# EAGLE schematic mbedXdotShield-V_1_0_0 (EAGLE 7.6.0)

## Sheet 1 of 5
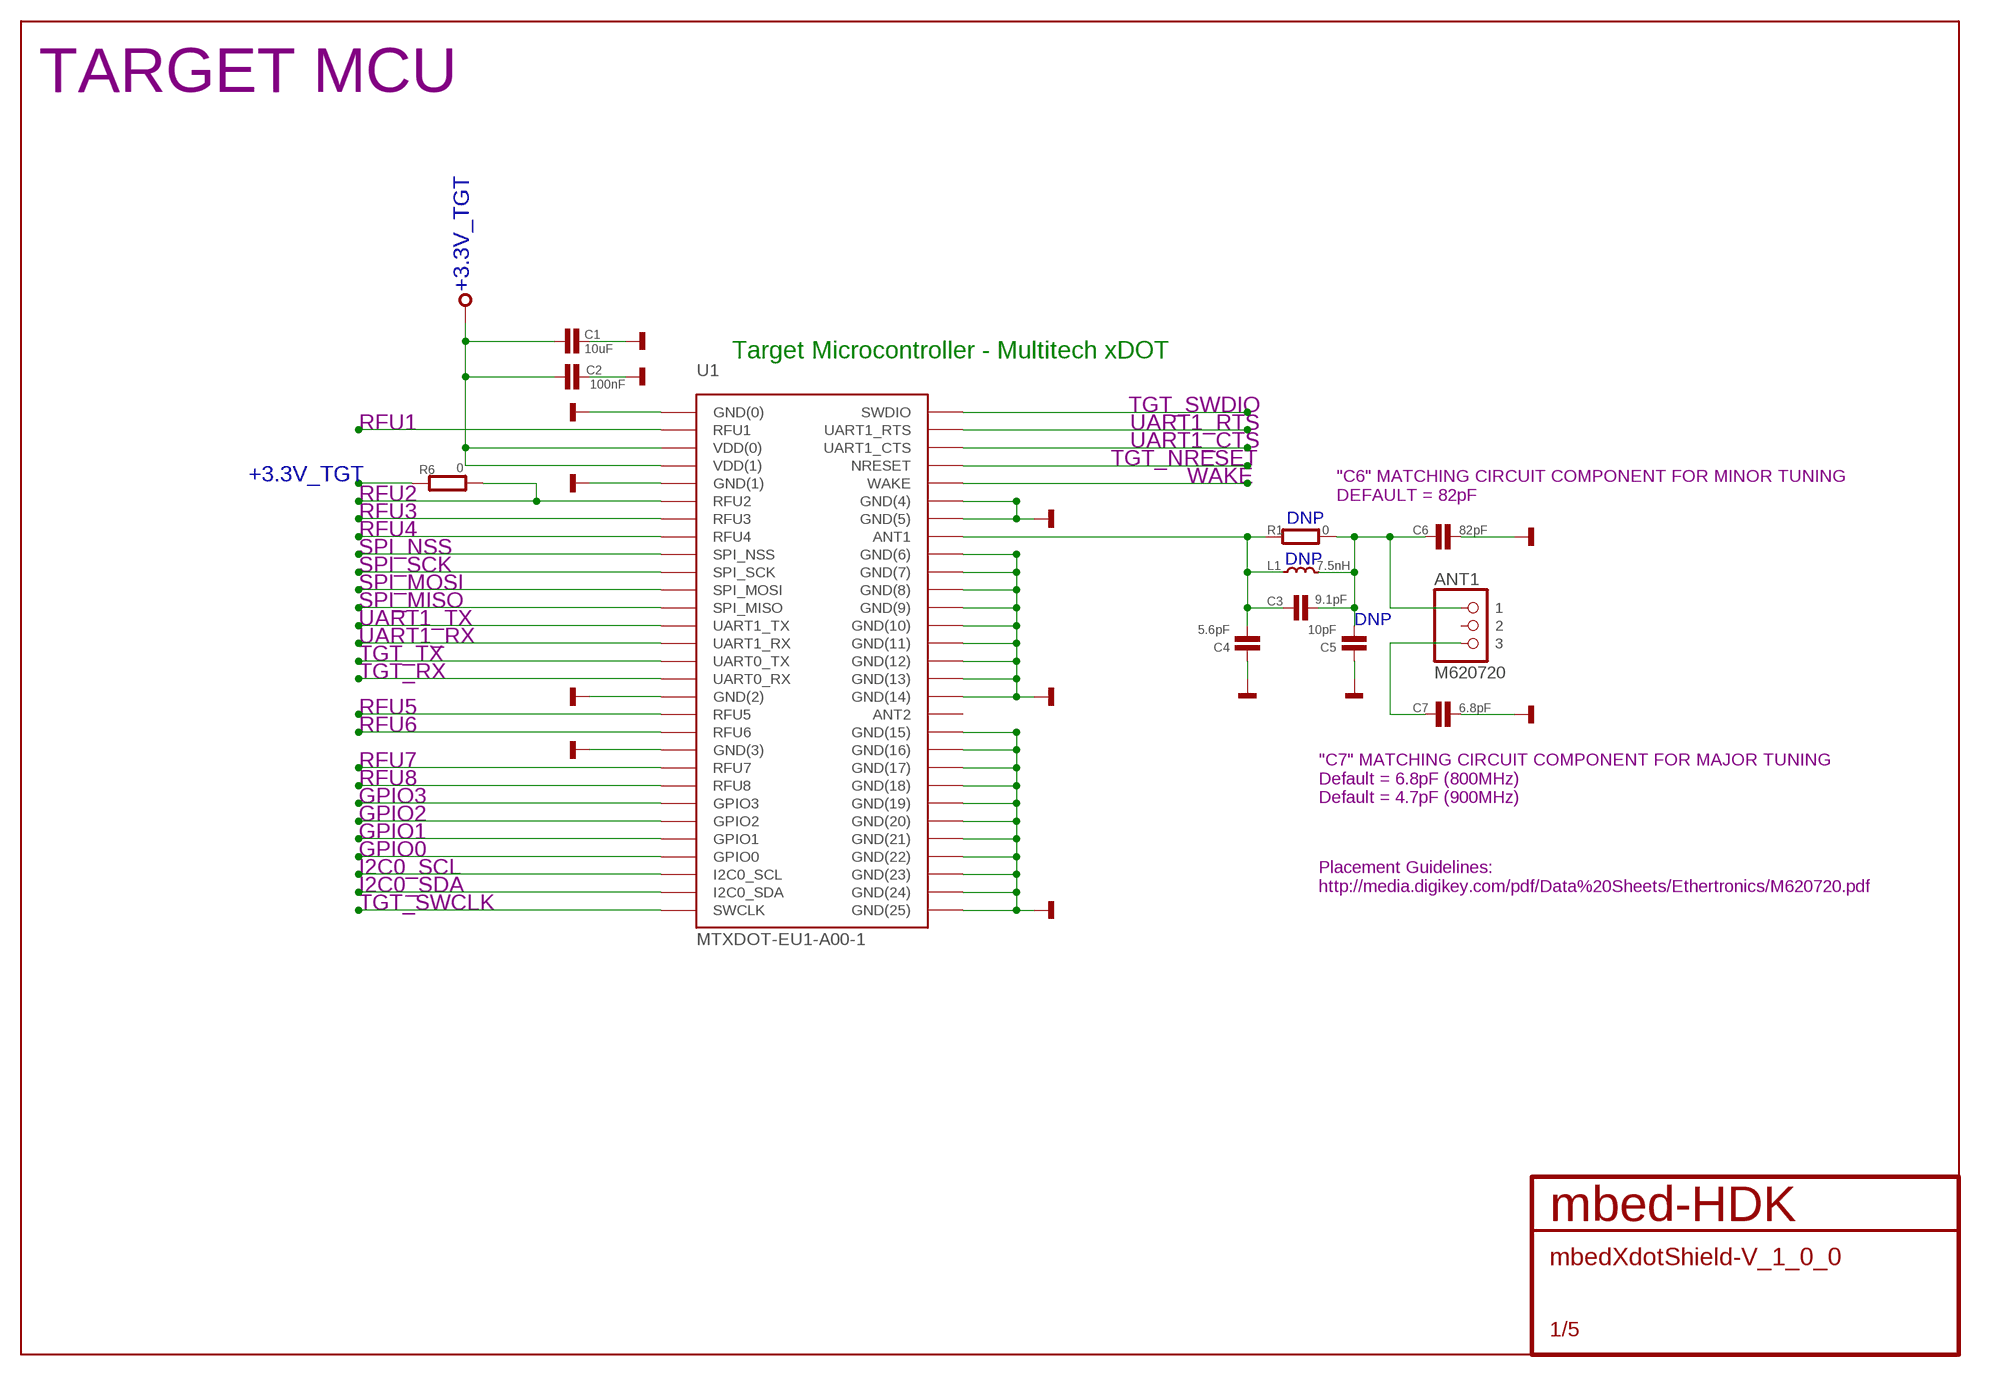
[diagram p0: schematic, sheet 1]

### Parts
ANT1  M620720  [M620720]
C1  10uF  CAPACITOR0603  [0603]
C2  100nF  CAPACITOR0603  [0603]
C3  9.1pF  CAPACITOR0402  [0402]
C4  5.6pF  CAPACITOR0402  [0402]
C5  10pF  CAPACITOR0402  [0402]
C6  82pF  CAPACITOR0402  [0402]
C7  6.8pF  CAPACITOR0402  [0402]
L1  7.5nH  INDUCTOR0402  [0402]
R1  0  RESISTOR0402  [0402]
R6  0  RESISTOR0402  [0402]
U1  MTXDOT-EU1-A00-1  [MTXDOT-EU1/NA1-A00-1]

### Nets
+3.3V_TGT: C1.1 C2.1 R6.1 U1.P$3(VDD(0)) U1.P$4(VDD(1)) ; also sheet 2,4,5
ANT1: C3.1 C4.2 L1.1 R1.1 U1.P$37(ANT1)
GND: C1.2 C2.2 C4.1 C5.1 C6.1 C7.1 U1.P$1(GND(0)) U1.P$5(GND(1)) U1.P$17(GND(2)) U1.P$20(GND(3)) U1.P$35(GND(4)) U1.P$36(GND(5)) U1.P$38(GND(6)) U1.P$39(GND(7)) U1.P$40(GND(8)) U1.P$41(GND(9)) U1.P$42(GND(10)) U1.P$43(GND(11)) U1.P$44(GND(12)) U1.P$45(GND(13)) U1.P$46(GND(14)) U1.P$48(GND(15)) U1.P$49(GND(16)) U1.P$50(GND(17)) U1.P$51(GND(18)) U1.P$52(GND(19)) U1.P$53(GND(20)) U1.P$54(GND(21)) U1.P$55(GND(22)) U1.P$56(GND(23)) U1.P$57(GND(24)) U1.P$58(GND(25)) ; also sheet 2,3,4,5
GPIO0: U1.P$26(GPIO0) ; also sheet 4
GPIO1: U1.P$25(GPIO1) ; also sheet 4
GPIO2: U1.P$24(GPIO2) ; also sheet 5
GPIO3: U1.P$23(GPIO3) ; also sheet 5
I2C0_SCL: U1.P$27(I2C0_SCL) ; also sheet 5
I2C0_SDA: U1.P$28(I2C0_SDA) ; also sheet 5
N$1: ANT1.P$3 C7.2
N$4: ANT1.P$1 C3.2 C5.2 C6.2 L1.2 R1.2
RFU1: U1.P$2(RFU1)
RFU2: R6.2 U1.P$6(RFU2)
RFU3: U1.P$7(RFU3)
RFU4: U1.P$8(RFU4)
RFU5: U1.P$18(RFU5)
RFU6: U1.P$19(RFU6)
RFU7: U1.P$21(RFU7)
RFU8: U1.P$22(RFU8)
SPI_MISO: U1.P$12(SPI_MISO) ; also sheet 4,5
SPI_MOSI: U1.P$11(SPI_MOSI) ; also sheet 4,5
SPI_NSS: U1.P$9(SPI_NSS) ; also sheet 4,5
SPI_SCK: U1.P$10(SPI_SCK) ; also sheet 4,5
TGT_NRESET: U1.P$33(NRESET) ; also sheet 3,5
TGT_RX: U1.P$16(UART0_RX) ; also sheet 3
TGT_SWCLK: U1.P$29(SWCLK) ; also sheet 3
TGT_SWDIO: U1.P$30(SWDIO) ; also sheet 3
TGT_TX: U1.P$15(UART0_TX) ; also sheet 3
UART1_CTS: U1.P$32(UART1_CTS) ; also sheet 5
UART1_RTS: U1.P$31(UART1_RTS) ; also sheet 5
UART1_RX: U1.P$14(UART1_RX) ; also sheet 5
UART1_TX: U1.P$13(UART1_TX) ; also sheet 5
WAKE: U1.P$34(WAKE) ; also sheet 5
Unconnected: ANT1.P$2 U1.P$47(ANT2)

### Notes on the sheet
- TARGET MCU
- Target Microcontroller - Multitech xDOT
- "C6" MATCHING CIRCUIT COMPONENT FOR MINOR TUNING
  DEFAULT = 82pF
- DNP
- DNP
- DNP
- "C7" MATCHING CIRCUIT COMPONENT FOR MAJOR TUNING
  Default = 6.8pF (800MHz)
  Default = 4.7pF (900MHz)
- Placement Guidelines:
  http://media.digikey.com/pdf/Data%20Sheets/Ethertronics/M620720.pdf

## Sheet 2 of 5
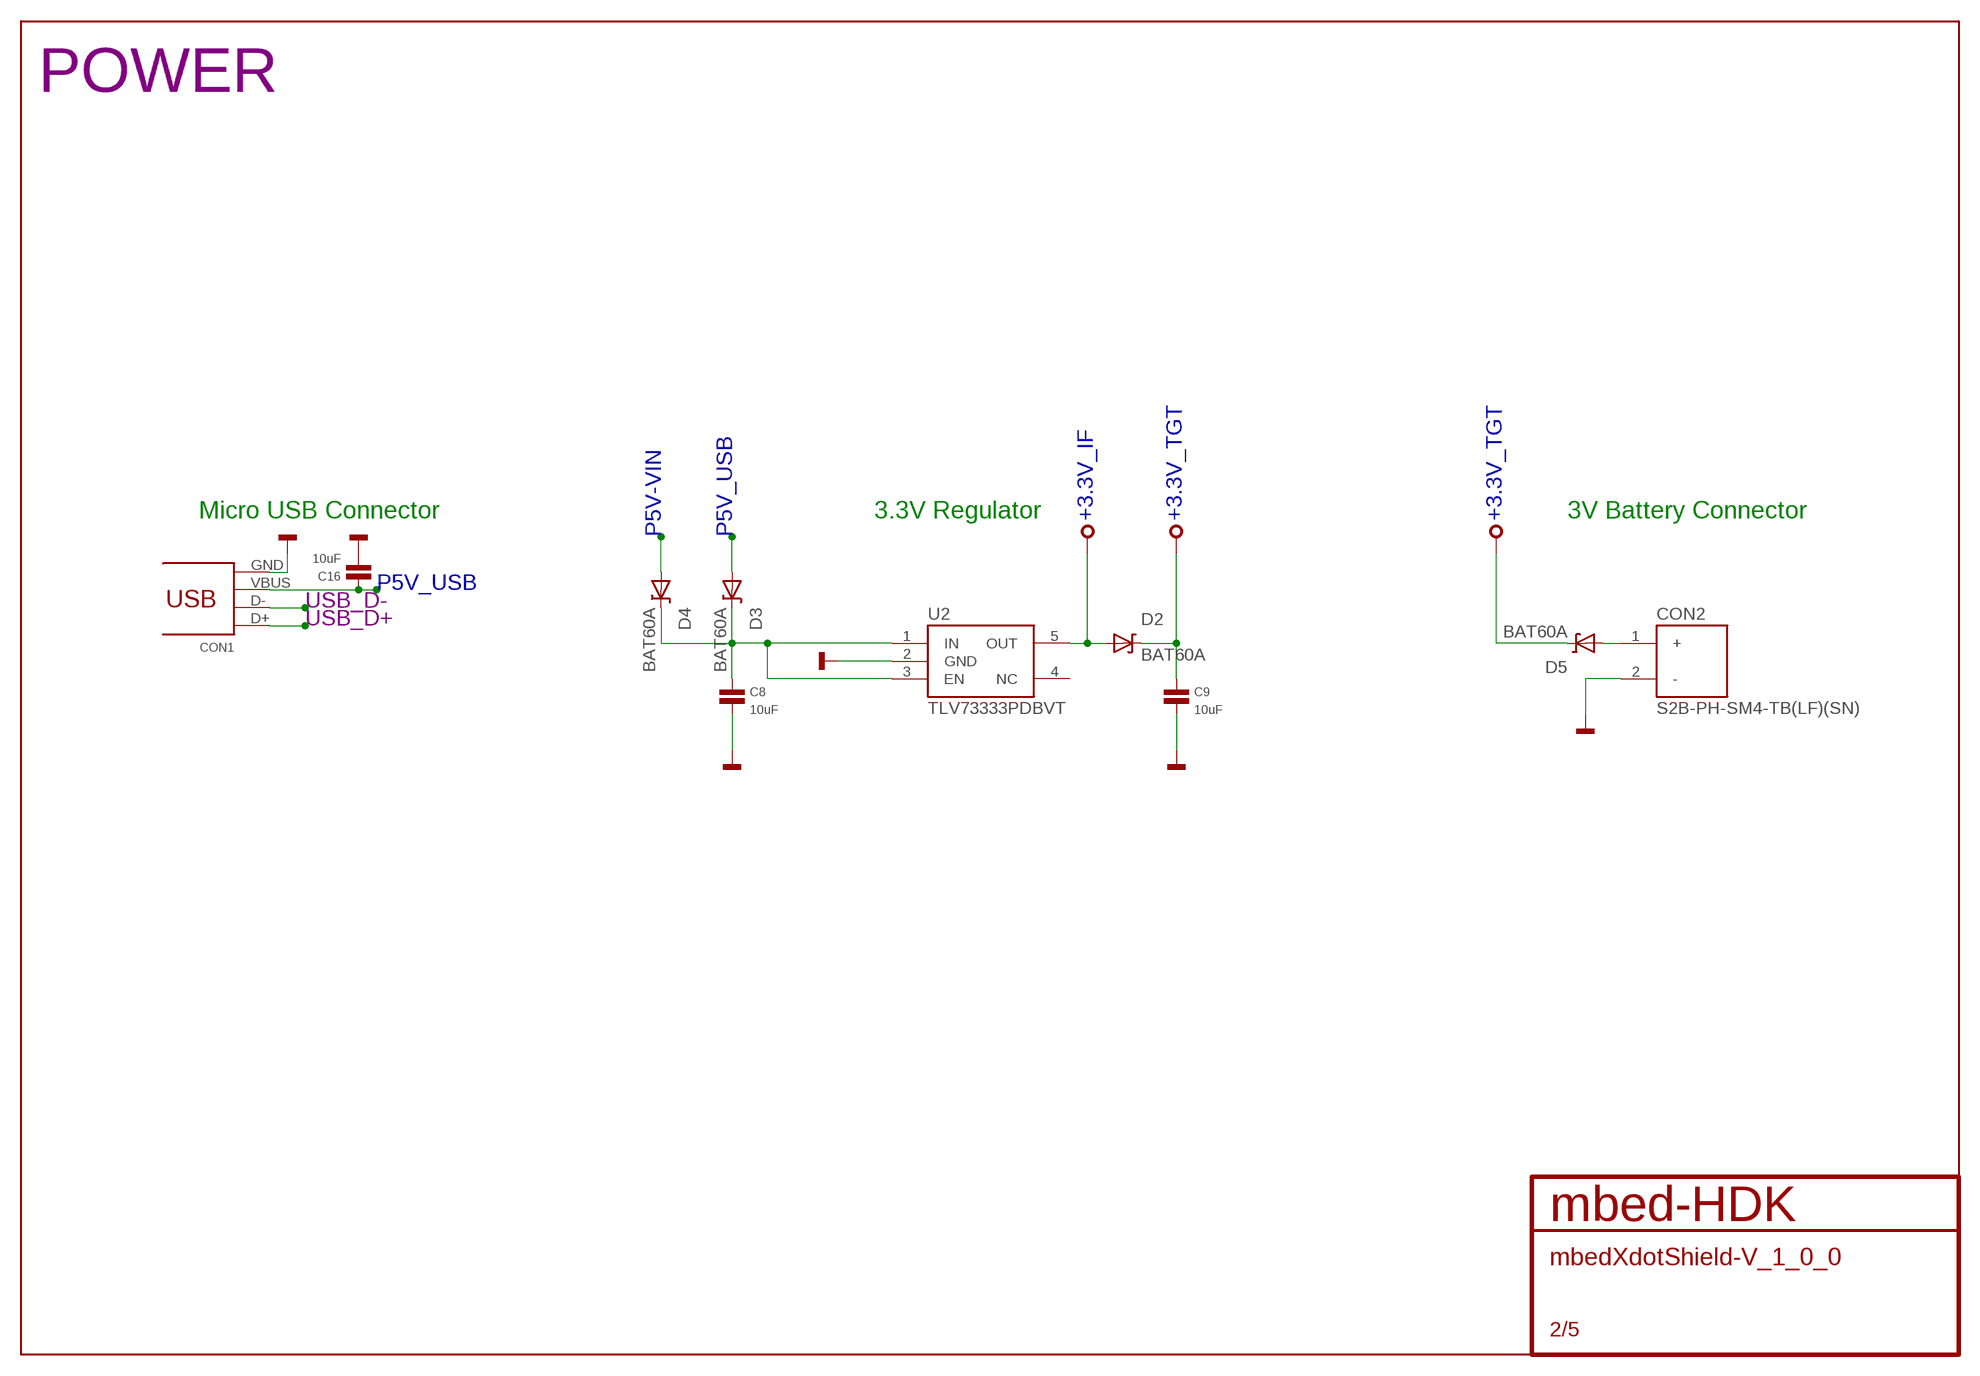
[diagram p1: schematic, sheet 2]

### Parts
C8  10uF  CAPACITOR0603  [0603]
C9  10uF  CAPACITOR0603  [0603]
C16  10uF  CAPACITOR0603  [0603]
CON1  47346-0001  [USB-MICRO-B-H]
CON2  S2B-PH-SM4-TB(LF)(SN)  [S2B-PH-SM4-TB(LF)(SN)]
D2  BAT60A  [SOD323]
D3  BAT60A  [SOD323]
D4  BAT60A  [SOD323]
D5  BAT60A  [SOD323]
U2  TLV73333PDBVT  [SOT23-5]

### Nets
+3.3V_IF: D2.A U2.5(OUT)
+3.3V_TGT: C9.1 D2.K D5.K ; also sheet 1,4,5
GND: C8.2 C9.2 C16.2 CON1.GND CON2.2(-) U2.2(GND) ; also sheet 1,3,4,5
N$25: C8.1 D3.K D4.K U2.1(IN) U2.3(EN)
N$47: CON2.1(+) D5.A
P5V-VIN: D4.A ; also sheet 5
P5V_USB: C16.1 CON1.VBUS D3.A ; also sheet 5
USB_D+: CON1.D+ ; also sheet 3
USB_D-: CON1.D- ; also sheet 3
Unconnected: U2.4(NC)

### Notes on the sheet
- POWER
- Micro USB Connector | 3.3V Regulator | 3V Battery Connector

## Sheet 3 of 5
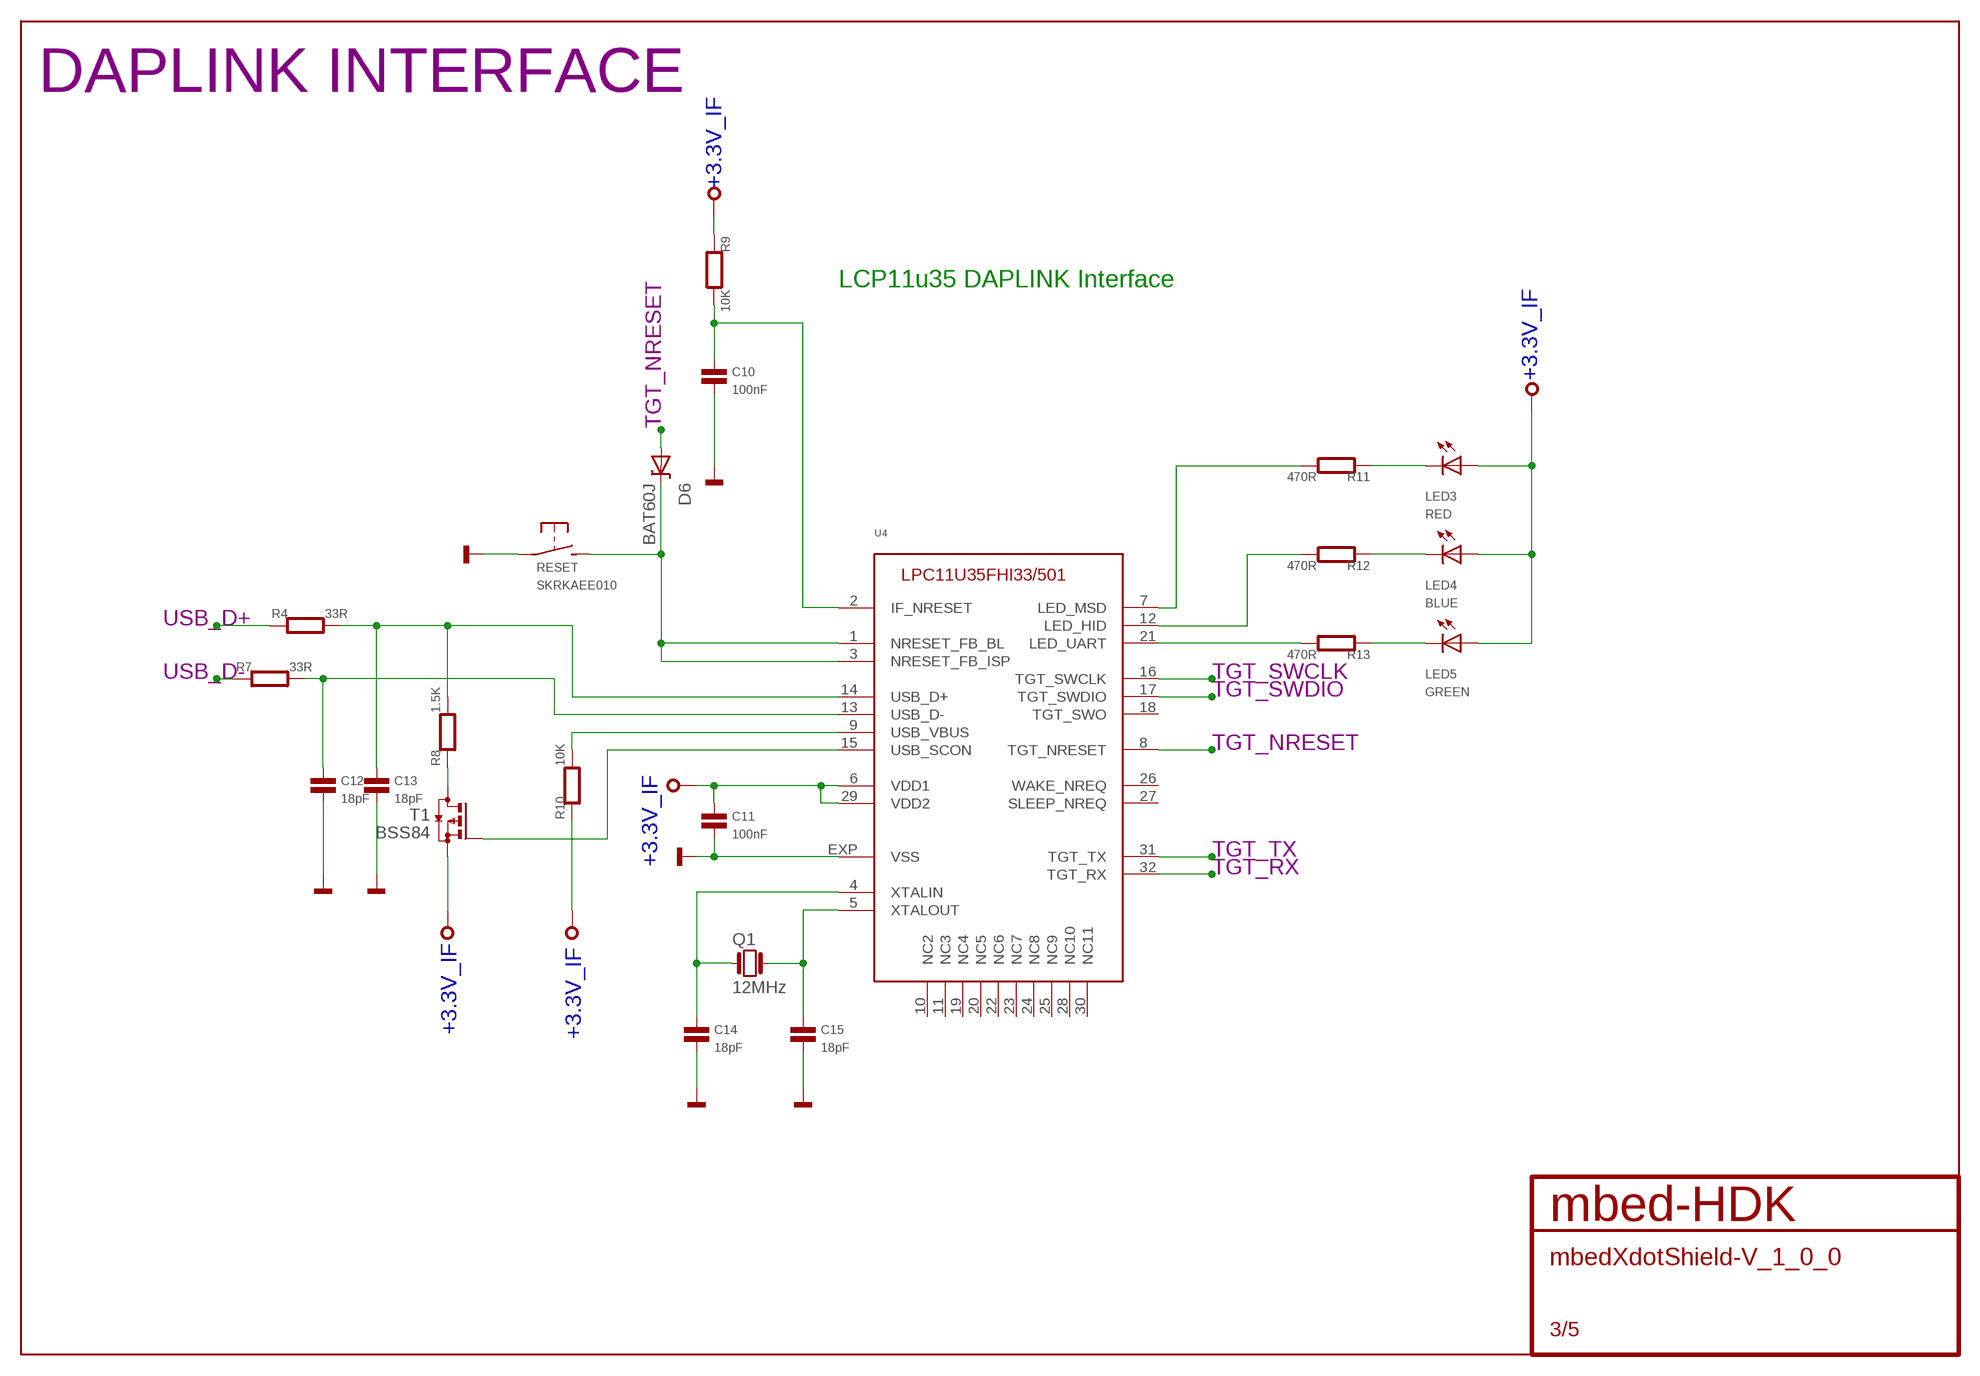
[diagram p2: schematic, sheet 3]

### Parts
C10  100nF  CAPACITOR0402  [0402]
C11  100nF  CAPACITOR0402  [0402]
C12  18pF  CAPACITOR0402  [0402]
C13  18pF  CAPACITOR0402  [0402]
C14  18pF  CAPACITOR0402  [0402]
C15  18pF  CAPACITOR0402  [0402]
D6  BAT60J  [SOD323]
LED3  RED  SMD_LED0603  [CHIPLED_0603]
LED4  BLUE  SMD_LED0603  [CHIPLED_0603]
LED5  GREEN  SMD_LED0603  [CHIPLED_0603]
Q1  12MHz  Q_3.2X2.5  [3.2X.2.5]
R4  33R  RESISTOR0402  [0402]
R7  33R  RESISTOR0402  [0402]
R8  1.5K  RESISTOR0402  [0402]
R9  10K  RESISTOR0402  [0402]
R10  10K  RESISTOR0402  [0402]
R11  470R  RESISTOR0402  [0402]
R12  470R  RESISTOR0402  [0402]
R13  470R  RESISTOR0402  [0402]
RESET  SKRKAEE010  [SKRKAEE010]
T1  BSS84  [SOT23-3]
U4  IF-LPC11U35  [HVQFN33]

### Nets
+3,3V: C11.1 LED3.A LED4.A LED5.A R9.1 R10.1 T1.2(S) U4.6(VDD1) U4.29(VDD2) ; supply symbol labelled +3.3V_IF
GND: C10.2 C11.2 C12.2 C13.2 C14.2 C15.2 RESET.P$1(P) U4.EXP(VSS) ; also sheet 1,2,4,5
HID: R12.2 U4.12(LED_HID)
IF_NRESET: C10.1 R9.2 U4.2(IF_NRESET)
ISP: D6.K RESET.P$2(S) U4.1(NRESET_FB_BL) U4.3(NRESET_FB_ISP)
MSD: R11.2 U4.7(LED_MSD)
N$21: C13.1 R4.2 R8.2 U4.14(USB_D+)
N$24: C12.1 R7.2 U4.13(USB_D-)
N$26: T1.1(G) U4.15(USB_SCON)
N$27: R8.1 T1.3(D)
N$28: R10.2 U4.9(USB_VBUS)
N$34: LED3.C R11.1
N$35: LED4.C R12.1
N$36: LED5.C R13.1
N$37: C15.1 Q1.P$3 U4.5(XTALOUT)
N$40: C14.1 Q1.P$1 U4.4(XTALIN)
TGT_NRESET: D6.A U4.8(TGT_NRESET) ; also sheet 1,5
TGT_RX: U4.32(TGT_RX) ; also sheet 1
TGT_SWCLK: U4.16(TGT_SWCLK) ; also sheet 1
TGT_SWDIO: U4.17(TGT_SWDIO) ; also sheet 1
TGT_TX: U4.31(TGT_TX) ; also sheet 1
UART: R13.2 U4.21(LED_UART)
USB_D+: R4.1 ; also sheet 2
USB_D-: R7.1 ; also sheet 2
Unconnected: U4.10(NC2) U4.11(NC3) U4.18(TGT_SWO) U4.19(NC4) U4.20(NC5) U4.22(NC6) U4.23(NC7) U4.24(NC8) U4.25(NC9) U4.26(WAKE_NREQ) U4.27(SLEEP_NREQ) U4.28(NC10) U4.30(NC11)

### Notes on the sheet
- DAPLINK INTERFACE
- LCP11u35 DAPLINK Interface

## Sheet 4 of 5
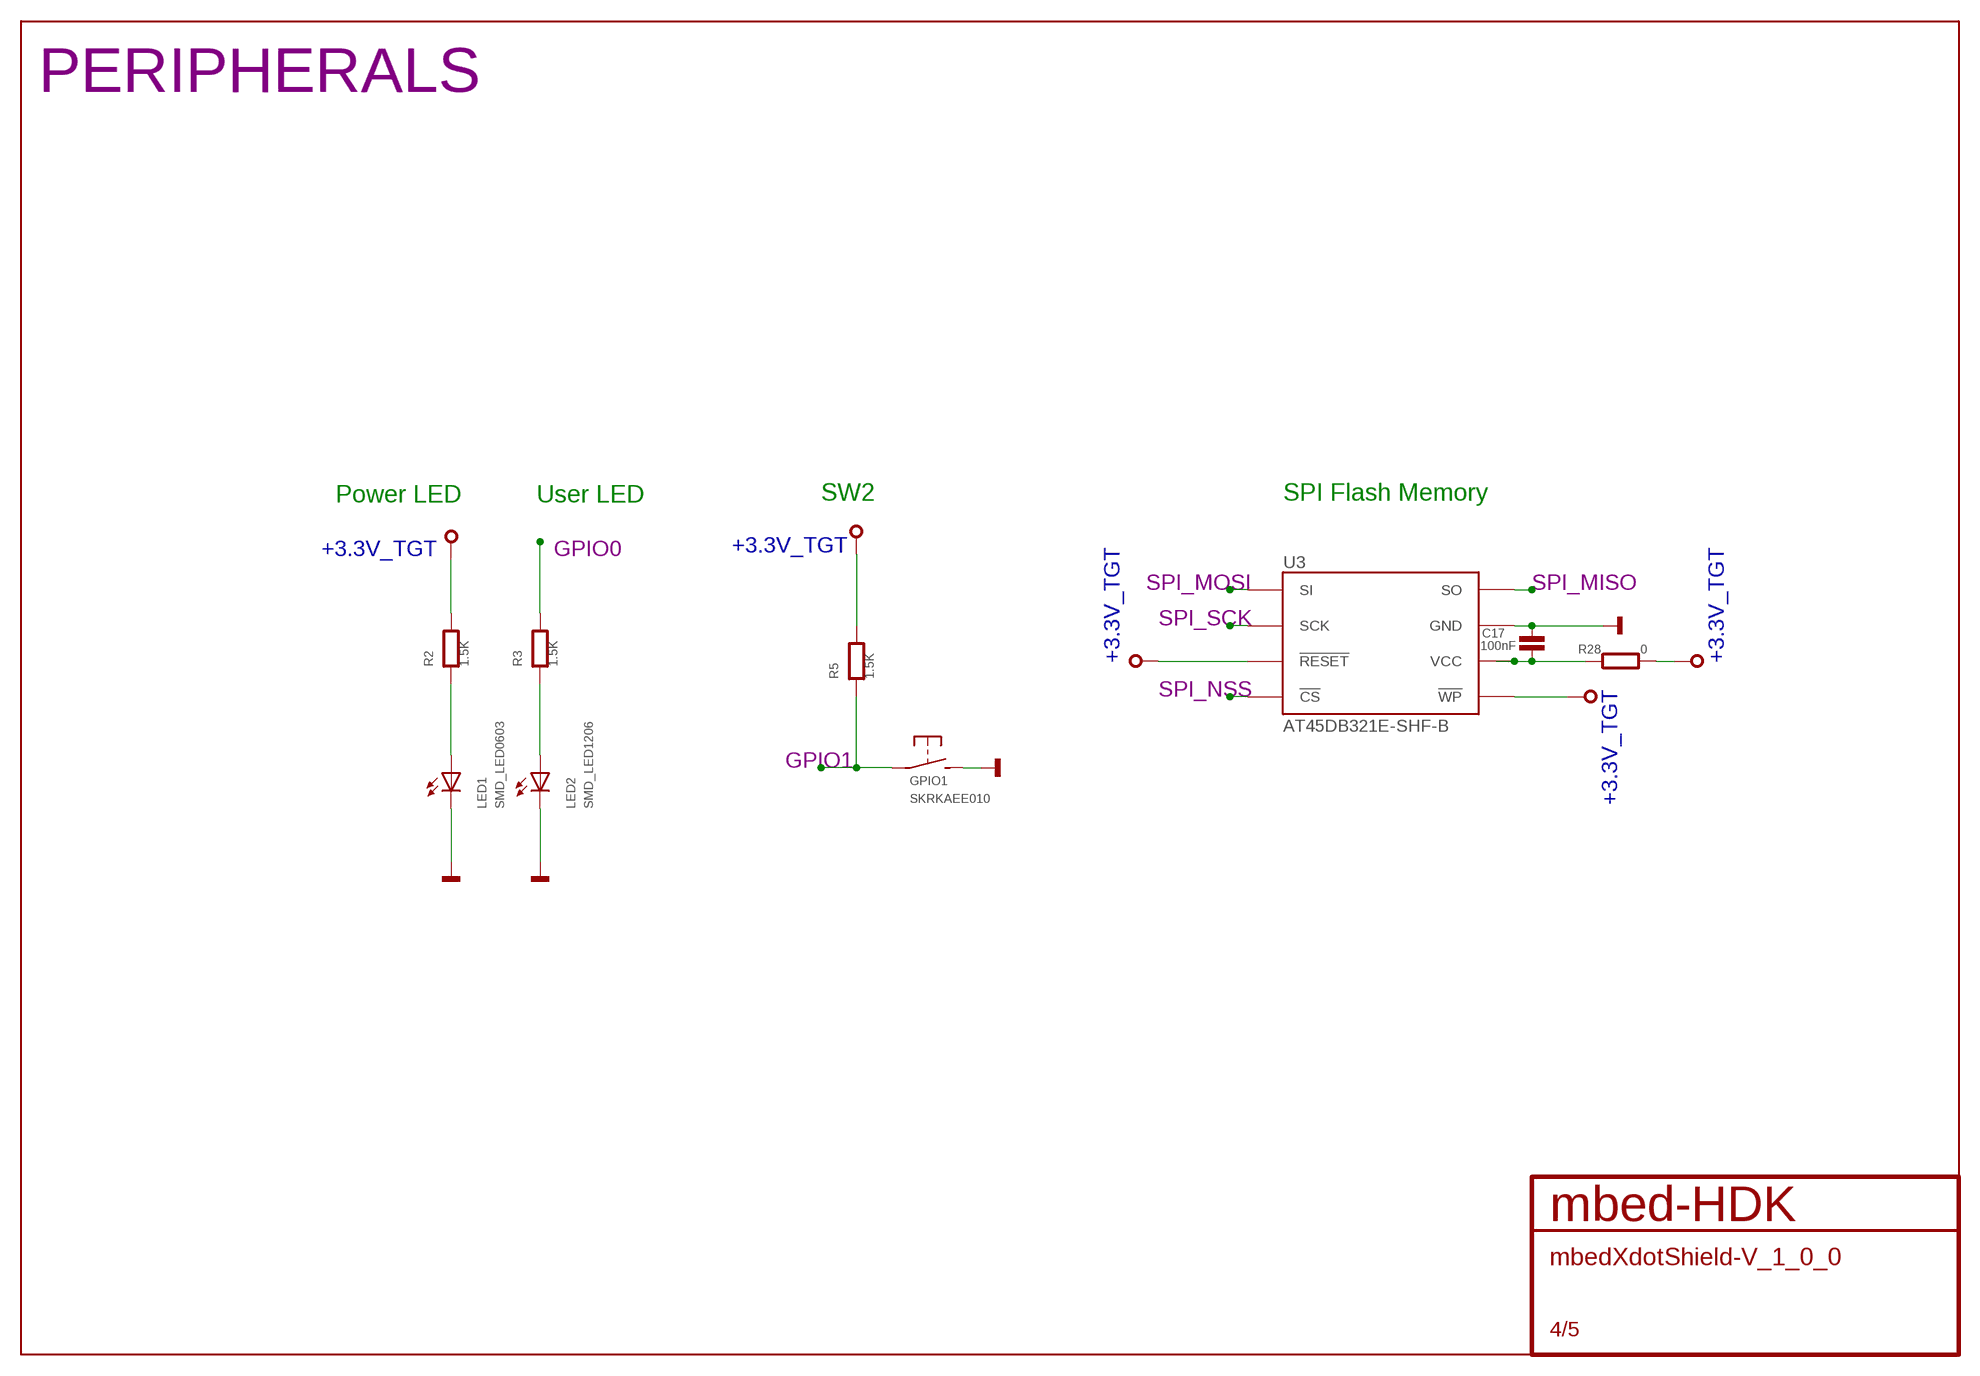
[diagram p3: schematic, sheet 4]

### Parts
C17  100nF  CAPACITOR0603  [0603]
GPIO1  SKRKAEE010  [SKRKAEE010]
LED1  SMD_LED0603  [CHIPLED_0603]
LED2  SMD_LED1206  [CHIPLED_1206]
R2  1.5K  RESISTOR0402  [0402]
R3  1.5K  RESISTOR0402  [0402]
R5  1.5K  RESISTOR0402  [0402]
R28  0  RESISTOR0402  [0402]
U3  AT45DB321E-SHF-B  [SO8]

### Nets
+3.3V_TGT: R2.2 R5.2 R28.2 U3.3(!RESET) U3.5(!WP) ; also sheet 1,2,5
GND: C17.1 GPIO1.P$2(S) LED1.C LED2.C U3.7(GND) ; also sheet 1,2,3,5
GPIO0: R3.2 ; also sheet 1
GPIO1: GPIO1.P$1(P) R5.1 ; also sheet 1
N$22: LED2.A R3.1
N$23: LED1.A R2.1
N$48: C17.2 R28.1 U3.6(VCC)
SPI_MISO: U3.8(SO) ; also sheet 1,5
SPI_MOSI: U3.1(SI) ; also sheet 1,5
SPI_NSS: U3.4(!CS) ; also sheet 1,5
SPI_SCK: U3.2(SCK) ; also sheet 1,5

### Notes on the sheet
- PERIPHERALS
- Power LED | User LED | SW2 | SPI Flash Memory

## Sheet 5 of 5
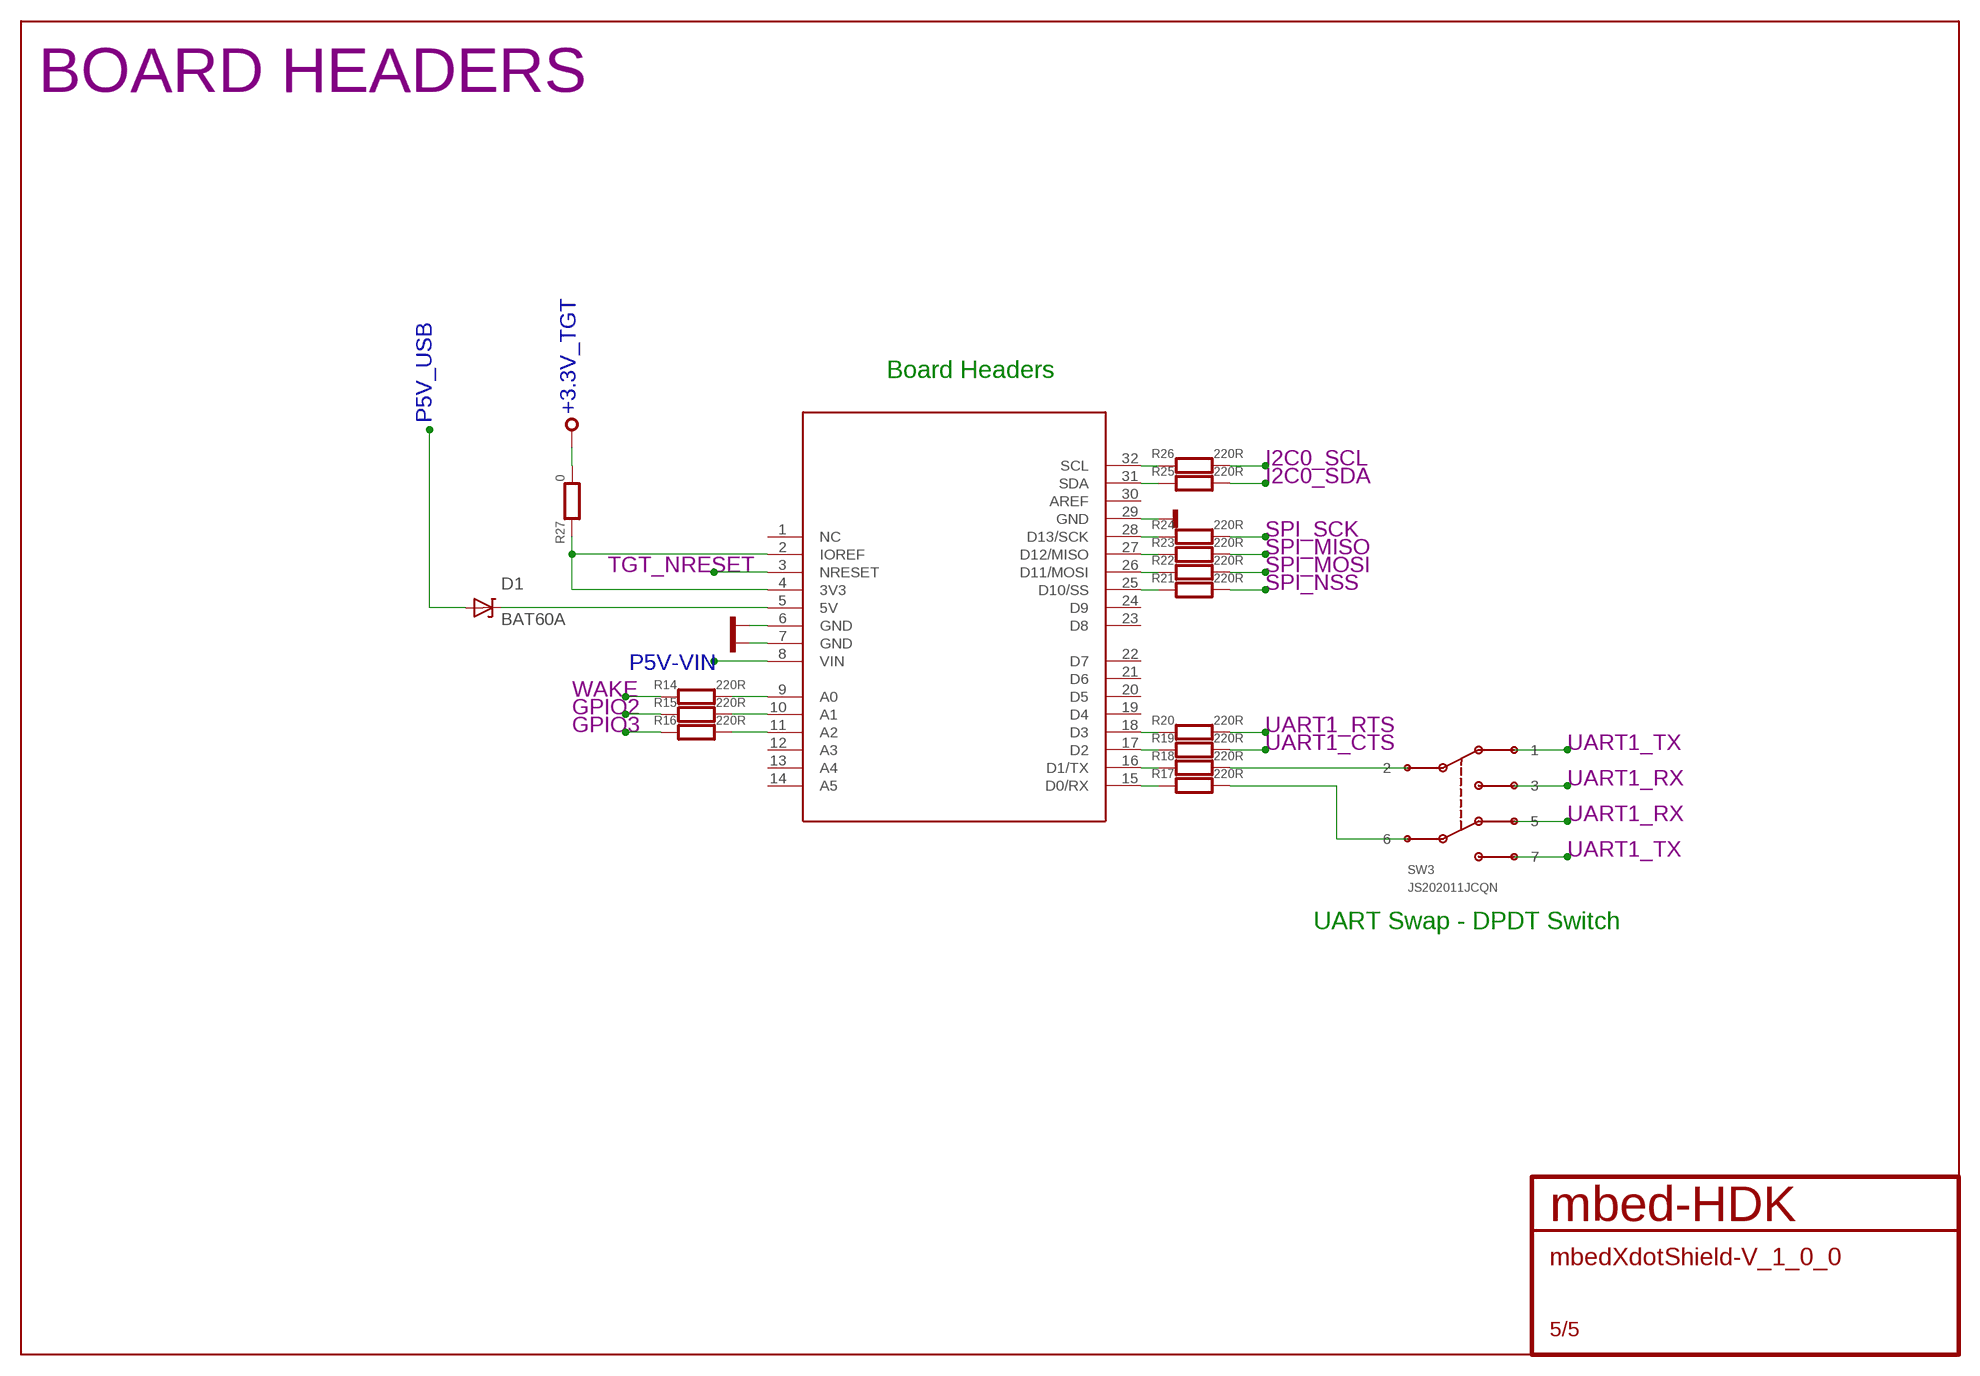
[diagram p4: schematic, sheet 5]

### Parts
BRD1  K64F/K22F-SHIELD  [K64F/K22F]
D1  BAT60A  [SOD323]
R14  220R  RESISTOR0402  [0402]
R15  220R  RESISTOR0402  [0402]
R16  220R  RESISTOR0402  [0402]
R17  220R  RESISTOR0402  [0402]
R18  220R  RESISTOR0402  [0402]
R19  220R  RESISTOR0402  [0402]
R20  220R  RESISTOR0402  [0402]
R21  220R  RESISTOR0402  [0402]
R22  220R  RESISTOR0402  [0402]
R23  220R  RESISTOR0402  [0402]
R24  220R  RESISTOR0402  [0402]
R25  220R  RESISTOR0402  [0402]
R26  220R  RESISTOR0402  [0402]
R27  0  RESISTOR0402  [0402]
SW3  JS202011JCQN  [JS202011JCQN]

### Nets
+3.3V_TGT: R27.2 ; also sheet 1,2,4
GND: BRD1.6(GND) BRD1.7(GND) BRD1.29(GND) ; also sheet 1,2,3,4
GPIO2: R15.1 ; also sheet 1
GPIO3: R16.1 ; also sheet 1
I2C0_SCL: R26.2 ; also sheet 1
I2C0_SDA: R25.2 ; also sheet 1
N$20: BRD1.9(A0) R14.2
N$29: BRD1.10(A1) R15.2
N$30: BRD1.11(A2) R16.2
N$31: BRD1.15(D0/RX) R17.1
N$32: BRD1.16(D1/TX) R18.1
N$33: BRD1.17(D2) R19.1
N$38: BRD1.5(5V) D1.K
N$39: BRD1.18(D3) R20.1
N$41: BRD1.25(D10/SS) R21.1
N$42: BRD1.26(D11/MOSI) R22.1
N$43: BRD1.27(D12/MISO) R23.1
N$44: BRD1.28(D13/SCK) R24.1
N$45: BRD1.31(SDA) R25.1
N$46: BRD1.32(SCL) R26.1
N$49: BRD1.2(IOREF) BRD1.4(3V3) R27.1
N$50: R17.2 SW3.6
N$51: R18.2 SW3.2
P5V-VIN: BRD1.8(VIN) ; also sheet 2
P5V_USB: D1.A ; also sheet 2
SPI_MISO: R23.2 ; also sheet 1,4
SPI_MOSI: R22.2 ; also sheet 1,4
SPI_NSS: R21.2 ; also sheet 1,4
SPI_SCK: R24.2 ; also sheet 1,4
TGT_NRESET: BRD1.3(NRESET) ; also sheet 1,3
UART1_CTS: R19.2 ; also sheet 1
UART1_RTS: R20.2 ; also sheet 1
UART1_RX: SW3.3 SW3.5 ; also sheet 1
UART1_TX: SW3.1 SW3.7 ; also sheet 1
WAKE: R14.1 ; also sheet 1
Unconnected: BRD1.1(NC) BRD1.12(A3) BRD1.13(A4) BRD1.14(A5) BRD1.19(D4) BRD1.20(D5) BRD1.21(D6) BRD1.22(D7) BRD1.23(D8) BRD1.24(D9) BRD1.30(AREF)

### Notes on the sheet
- BOARD HEADERS
- Board Headers
- UART Swap - DPDT Switch

## Library data of the parts
ANT1 = mbed-HDK-RF:M620720: Chip Antenna Ceramic ISM/M2M/IoT 868/915MHz; MF: Ethertronics; MFN: M620720; OC-DIGIKEY: 939-1066-1-ND
BRD1 = mbed-HDK-misc-Board:K64F/K22F-SHIELD: Shield for K64F/K22F
C1-C17 = mbed-HDK-RLCQ:CAPACITOR: Capacitor
CON1 = mbed-HDK-Connector:47346-0001: USB Receptacle Horizontal Micro Type B; MF: MOLEX; MFN: 47346-0001; OC-MOUSER: 538-47346-0001; OC-NEWARK: 1568026
CON2 = mbed-HDK-Connector:S2B-PH-SM4-TB(LF)(SN): 2 Position 2 mm JST PH Series Pitch Surface Mount Side Entry Shrouded Header; MF: JST; MFN: S2B-PH-SM4-TB(LF)(SN); OC-DIGIKEY: 455-1749-1-ND; OC-NEWARK: 38K8067
D1-D5 = mbed-HDK-Transistor:BAT60A: SCHOTTKY DIODE; MF: Infineon; MFN: BAT60AE6327HTSA1; OC-DIGIKEY: BAT60AE6327HTSA1CT-ND; OC-MOUSER: 726-BAT60AE6327; OC-NEWARK: 85X4127
D6 = mbed-HDK-Transistor:BAT60J: SCHOTTKY DIODE; MF: STMicroelectronics; MFN: BAT60JFILM; OC-DIGIKEY: 497-3707-6-ND; OC-MOUSER: 511-BAT60JFILM; OC-NEWARK: 89K1218
GPIO1 RESET = mbed-HDK-Switch:SKRKAEE010: MOMENTARY SWITCH PUSH VERTICAL (SPST); MF: ALPS; MFN: SKRKAEE010; OC-MOUSER: 688-SKRKAE
L1 = mbed-HDK-RLCQ:INDUCTOR: Inductor
LED1 LED3-LED5 = mbed-HDK-Optical:SMD_LED: LED SMD, Colour Red; MF: Wurth Electronics Inc; MFN: 150060RS75000; OC-DIGIKEY: 732-4978-1-ND; OC-MOUSER: 710-150060RS75000; OC-NEWARK: 2322071
LED2 = mbed-HDK-Optical:SMD_LED: LED SMD, Colour Red; MF: Wurth Electronics Inc; MFN: 150120GS75000; OC-DIGIKEY: 732-4990-1-ND; OC-MOUSER: 710-150120GS75000; OC-NEWARK: 2322085
Q1 = mbed-HDK:Q
R1-R28 = mbed-HDK-RLCQ:RESISTOR: Resistor
SW3 = mbed-HDK-Switch:JS202011JCQN: SLIDE TOGGLE SWITCH VERTICAL (DPDT); MF: C&K Components; MFN: JS202011JCQN; OC-DIGIKEY: CKN10723CT-ND; OC-MOUSER: 611-JS202011JCQN
T1 = mbed-HDK-Transistor:BSS84: MOSFET P-CHANNEL; MF: Fairchild Semiconductor; MFN: BSS84; OC-DIGIKEY: BSS84CT-ND; OC-MOUSER: 512-BSS84; OC-NEWARK: 58K8770
U1 = mbed-HDK-MF-MULTITECH:MTXDOT-EU1-A00-1: Multitech xDOT LORA MODULE UFL/TRC 868MHz for Europe; MF: Multi-Tech Systems Inc.; MFN: MTXDOT-EU1-A00-1; OC-DIGIKEY: 591-1292-ND
U2 = mbed-HDK-Power:TLV73333PDBVT: LDO Fixed Regulator 3.3v, 300mA; MF: Texas Instruments; MFN: TLV73333PDBVT; OC-DIGIKEY: 296-38492-1-ND; OC-MOUSER: 595-TLV73333PDBVT; OC-NEWARK: 2455145
U3 = mbed-HDK-IC:AT45DB321E-SHF-B: Serial Flash 32 Mb 85 Mhz; MF: Adesto Technologies; MFN: AT45DB321E-SHF-B; OC-DIGIKEY: 1265-1072-5-ND; OC-MOUSER: 988-AT45DB321E-SHF-B; OC-NEWARK: 2414318
U4 = mbed-HDK:IF-LPC11U35